# EAGLE design usb-2.0-current-probe (EAGLE 7.7.0)
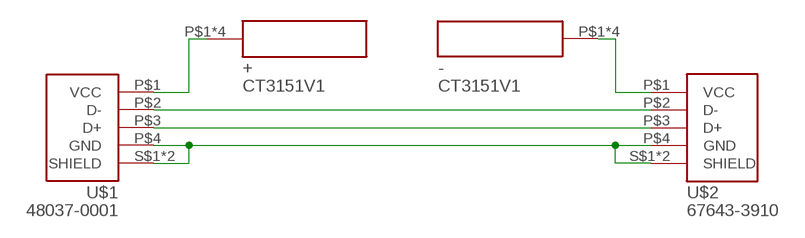
[diagram p0: schematic, sheet 1]

## Parts
+  CT3151V1  [CT3151V1]
-  CT3151V1  [CT3151V1]
U$1  48037-0001  [48037-0001]
U$2  67643-3910  [67643-3910]

## Nets
GND: U$1.P$4(GND) U$1.S$1(SHIELD) U$1.S$2(SHIELD) U$2.P$4(GND) U$2.S$1(SHIELD) U$2.S$2(SHIELD)
N$5: U$1.P$2(D-) U$2.P$2(D-)
N$6: U$1.P$3(D+) U$2.P$3(D+)
VLOAD: -.P$1 -.P$2 -.P$3 -.P$4 U$2.P$1(VCC)
VUSB: +.P$1 +.P$2 +.P$3 +.P$4 U$1.P$1(VCC)

## Library data of the parts
+ - = Glen-CalTestElectronics:CT3151V1
U$1 = Glen-MolexUSB:48037-0001
U$2 = Glen-MolexUSB:67643-3910

## Board
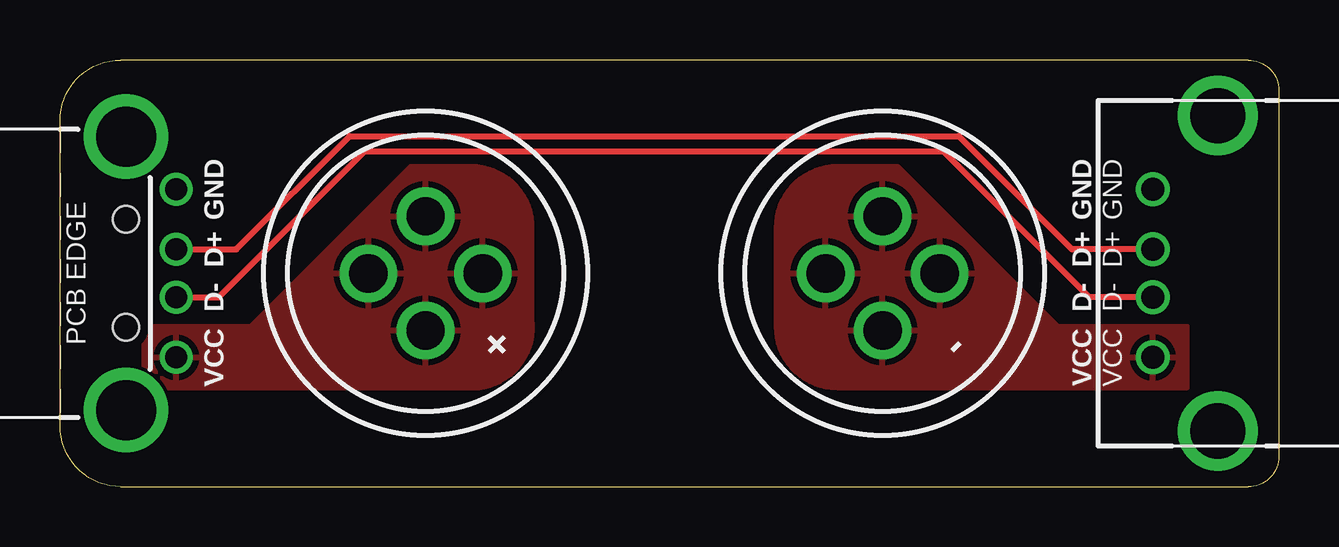
[diagram p1: board, top side]
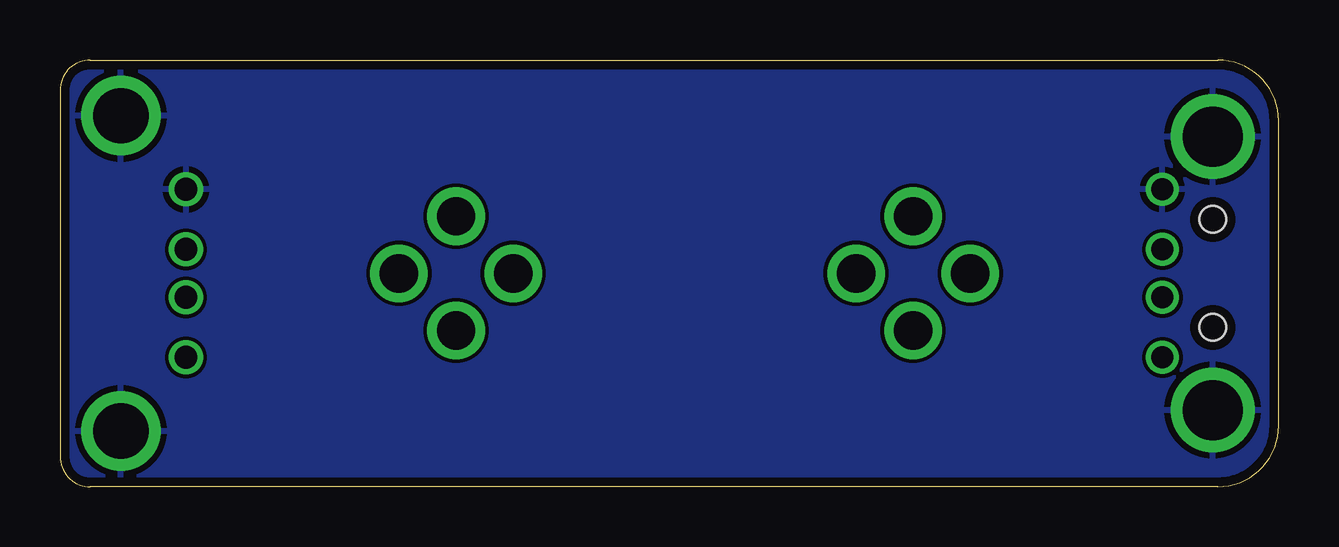
[diagram p2: board, bottom side, seen from below]

Size 50.8 x 17.78 mm. Coordinates in mm from the lower left corner, seen from the top.
Outline: 2.54,0 49.53,0 arc90 50.8,1.27 50.8,16.51 arc90 49.53,17.78 2.54,17.78 arc90 0,15.24 0,2.54 arc90 2.54,0
Copper layers (1*16): Top 0.035559375mm / dielectric 1.6mm / Bottom 0.035559375mm
Design rules "oshpark-2layer-2018": minimum track width 6mil, minimum drill 10mil, track to track 6mil, track to pad 6mil, pad to pad 6mil, via to via 6mil, smd to smd 6mil, copper to edge 15mil, drill to drill 6mil, minimum pad ring 5mil, minimum via ring 5mil, stop-mask expansion 2.5mil, vias tented up to drill 0mil, thermal gap 10mil

### Footprints (pad centres in the part's own frame; a part is rotated, then mirrored left to right if it is on the bottom)
CT3151V1 = drill 1.6: P$1 0,2.38; P$2 0,-2.38; P$3 2.38,0; P$4 -2.38,0
48037-0001 = drill 0.92: P$1 3.5,4.85; P$2 1,4.85; P$3 -1,4.85; P$4 -3.5,4.85 | drill 2.5: S$1 5.7,2.75; S$2 -5.7,2.75 | hole 1.1: 2.25,2.75; -2.25,2.75
67643-3910 = drill 0.95: P$1 -3.5,2.71; P$2 -1,2.71; P$3 1,2.71; P$4 3.5,2.71 | drill 2.3: S$1 6.57,0; S$2 -6.57,0

### Placement (x,y rotation side)
+  15.24,8.89 0 top
-  34.29,8.89 0 top
U$1  0,8.89 270 top
U$2  48.26,8.89 90 top

### Tracks (layer width: path | path; a pad name or v marks a point on that pad's centre or on a via)
GND
  pour Bottom (isolate 0.152): 0,17.78 0,0 50.8,0 50.8,17.78
N$5
  Top 0.254: U$1.P$2 6.62,7.89 12.7,13.97 36.83,13.97 42.91,7.89 U$2.P$2
N$6
  Top 0.254: U$1.P$3 7.35,9.89 12.06,14.61 37.47,14.61 42.18,9.89 U$2.P$3
VLOAD
  pour Top (isolate 0.152): 29.84,10.79 29.84,6.67 arc90 32.38,4.13 46.99,4.13 46.99,6.67 41.59,6.67 34.92,13.34 32.38,13.34 arc90
VUSB
  pour Top (isolate 0.152): 3.49,6.67 3.49,4.13 17.46,4.13 arc90 19.68,6.99 19.68,10.79 arc90 17.14,13.34 14.61,13.34 7.94,6.67

### Text on the board
_tsilk: GND | GND | D+ | D+ | D- | D- | + | - | VCC | VCC